# Altium schematic sheet mcu.SchDoc
size A4
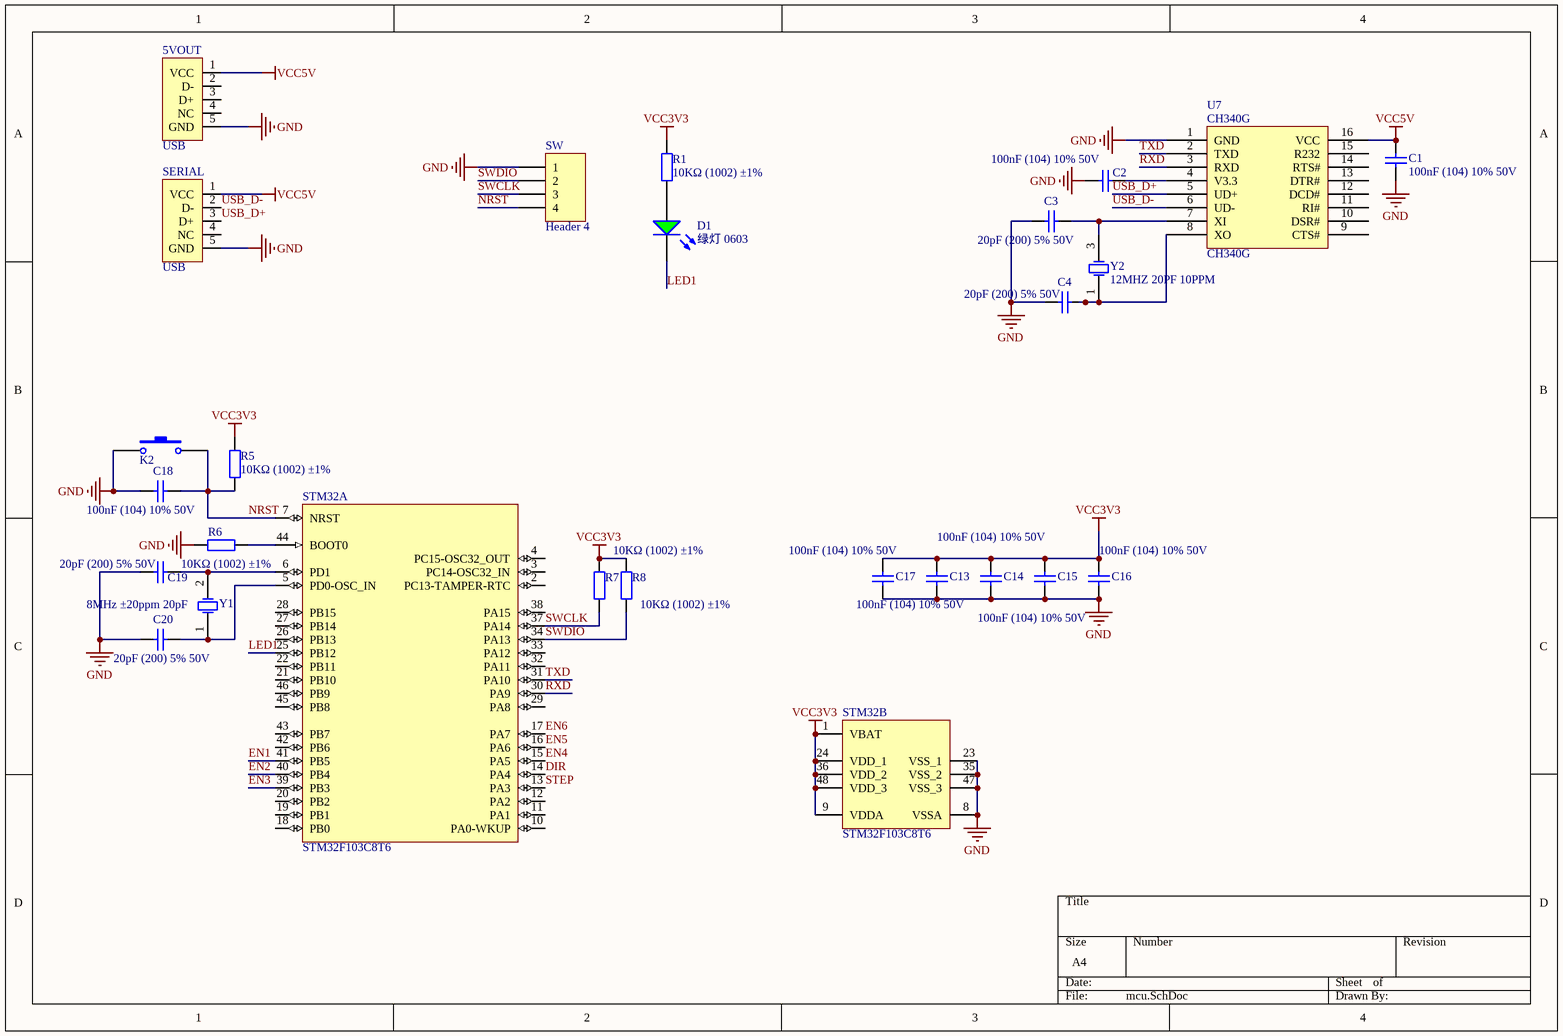
[diagram p0: mcu.SchDoc]

## Parts
5VOUT  USB  [USB_5]
C1  100nF (104) 10% 50V  [0603_C]
C2  100nF (104) 10% 50V  [0603_C]
C3  20pF (200) 5% 50V  [0603_C]
C4  20pF (200) 5% 50V  [0603_C]
C13  100nF (104) 10% 50V  [0603_C]
C14  100nF (104) 10% 50V  [0603_C]
C15  100nF (104) 10% 50V  [0603_C]
C16  100nF (104) 10% 50V  [0603_C]
C17  100nF (104) 10% 50V  [0603_C]
C18  100nF (104) 10% 50V  [0603_C]
C19  20pF (200) 5% 50V  [0603_C]
C20  20pF (200) 5% 50V  [0603_C]
D1  绿灯 0603  [0603_LED_S1]
K2  KEY  [Key_Sop]  (value not drawn)
R1  10KΩ (1002) ±1%  [0603_R]
R5  10KΩ (1002) ±1%  [0603_R]
R6  10KΩ (1002) ±1%  [0603_R]
R7  10KΩ (1002) ±1%  [0603_R]
R8  10KΩ (1002) ±1%  [0603_R]
SERIAL  USB  [USB_5]
STM32  STM32F103C8T6  [LQFP-48_7x7x05P]  (parts A,B of 2)
SW  Header 4  [HDR1X4]
U7  CH340G  [SOIC-16_150mil]
Y1  8MHz ±20ppm 20pF  [SMD-5032_2P]
Y2  12MHZ 20PF 10PPM  [SMD-3225_4P]

## Nets
GND: 5VOUT.5(GND) C1.1 C2.1 C3.2 C4.2 C13.1 C14.1 C15.1 C16.1 C17.1 C18.2 C19.1 C20.1 K2.1 R6.2 SERIAL.5(GND) STM32.8(VSSA) STM32.23(VSS_1) STM32.35(VSS_2) STM32.47(VSS_3) SW.1 U7.1(GND)
VCC3V3: C13.2 C14.2 C15.2 C16.2 C17.2 R1.1 R5.2 R7.2 R8.2 STM32.1(VBAT) STM32.9(VDDA) STM32.24(VDD_1) STM32.36(VDD_2) STM32.48(VDD_3)
VCC5V: 5VOUT.1(VCC) C1.2 SERIAL.1(VCC) U7.16(VCC)
DIR: STM32.14(PA4)
EN1: STM32.41(PB5)
EN2: STM32.40(PB4)
EN3: STM32.39(PB3)
EN4: STM32.15(PA5)
EN5: STM32.16(PA6)
EN6: STM32.17(PA7)
LED1: D1.K STM32.25(PB12)
NRST: C18.1 K2.2 R5.1 STM32.7(NRST) SW.4
RXD: STM32.30(PA9) U7.3(RXD)
STEP: STM32.13(PA3)
SWCLK: R7.1 STM32.37(PA14) SW.3
SWDIO: R8.1 STM32.34(PA13) SW.2
TXD: STM32.31(PA10) U7.2(TXD)
USB_D+: SERIAL.3(D+) U7.5(UD+)
USB_D-: SERIAL.2(D-) U7.6(UD-)
NetC2_2: C2.2 U7.4(V3.3)
NetC3_1: C3.1 U7.7(XI) Y2.3(OSC2)
NetC4_1: C4.1 U7.8(XO) Y2.1(OSC1)
NetC19_2: C19.2 STM32.6(PD1) Y1.2(OSC2)
NetC20_2: C20.2 STM32.5(PD0-OSC_IN) Y1.1(OSC1)
NetD1_A: D1.A R1.2
NetR6_1: R6.1 STM32.44(BOOT0)

Not connected (* = marked no-connect by the designer): 5VOUT 2(D-) 3(D+) 4(NC); SERIAL 4(NC); STM32 2(PC13-TAMPER-RTC) 3(PC14-OSC32_IN) 4(PC15-OSC32_OUT) 10(PA0-WKUP) 11(PA1) 12(PA2) 18(PB0) 19(PB1) 20(PB2) 21(PB10) 22(PB11) 26(PB13) 27(PB14) 28(PB15) 29(PA8) 32(PA11) 33(PA12) 38(PA15) 42(PB6) 43(PB7) 45(PB8) 46(PB9); U7 9(CTS#) 10(DSR#) 11(RI#) 12(DCD#) 13(DTR#) 14(RTS#) 15(R232)

## Library data of the parts
5VOUT SERIAL = USB_2
C1 C2 C13-C18 = 0603 100nF (104) 10% 50V: 贴片电容; ComponentLink1Description: 供应商链接; ComponentLink1URL: http://www.szlcsc.com/product/details_15331.html; Package: 0603; Supplier: LC; SuppliersPartNumber: C14663
C3 C4 C19 C20 = 0603 20pF (200) 5% 50V: 贴片电容; ComponentLink1Description: 供应商链接; ComponentLink1URL: http://www.szlcsc.com/product/details_2000.html; Package: 0603; Supplier: LC; SuppliersPartNumber: C1648
D1 = 0603 绿灯: 发光二极管; ComponentLink1Description: 供应商链接; ComponentLink1URL: http://www.szlcsc.com/product/details_73152.html; Package: 0603; Supplier: LC; SuppliersPartNumber: C72043
K2 = KEY_SOP: 贴片按键
R1 R5-R8 = 0603 10KΩ (1002) 1%: 贴片电阻; ComponentLink1Description: 供应商链接; ComponentLink1URL: http://www.szlcsc.com/product/details_26547.html; Package: 0603; Supplier: LC; SuppliersPartNumber: C25804
STM32 = STM32F103C8T6: ARM; ComponentLink1Description: 供应商链接; ComponentLink1URL: http://www.szlcsc.com/product/details_9243.html; Package: LQFP-48_7x7x05P; Supplier: LC; SuppliersPartNumber: C8734
SW = Header 4: Header, 4-Pin; LatestRevisionDate: 17-Jul-2002; LatestRevisionNote: Re-released for DXP Platform.; Publisher: Altium Limited
U7 = CH340G_[C14267]: USB; ComponentLink1Description: 供应商链接; ComponentLink1URL: http://www.szlcsc.com/product/details_14927.html; Package: SOIC-16_150mil; Supplier: LC; SuppliersPartNumber: C14267
Y1 = SMD-5032_2P 8MHz 20ppm 20pF: 贴片晶振; ComponentLink1Description: 供应商链接; ComponentLink1URL: http://www.szlcsc.com/product/details_117214.html; Package: SMD-5032_2P; Supplier: LC; SuppliersPartNumber: C115962
Y2 = SMD-3225_4P  12MHZ 20PF 10PPM: 贴片晶振; ComponentLink1Description: 供应商链接; ComponentLink1URL: http://www.szlcsc.com/product/details_9522.html; Package: SMD-3225_4P; Supplier: LC; SuppliersPartNumber: C9002